# Altium schematic sheet VNA_9.SchDoc: VNA
size 409 x 289 mm; Origin: Eagle; OriginPath: C:\Users\Ground Lab\Desktop\LibreVNA\Hardware\Eagle\VNA.sch; OriginSheet: 10; Date: 04.05.2025 20:03:37; SheetNumber: 10; GateName_1: G$1; SymbolName_1: A3L-LOC; LibraryName: VNA; DeviceSetName: A3L-LOC; Sheet: Sheet:
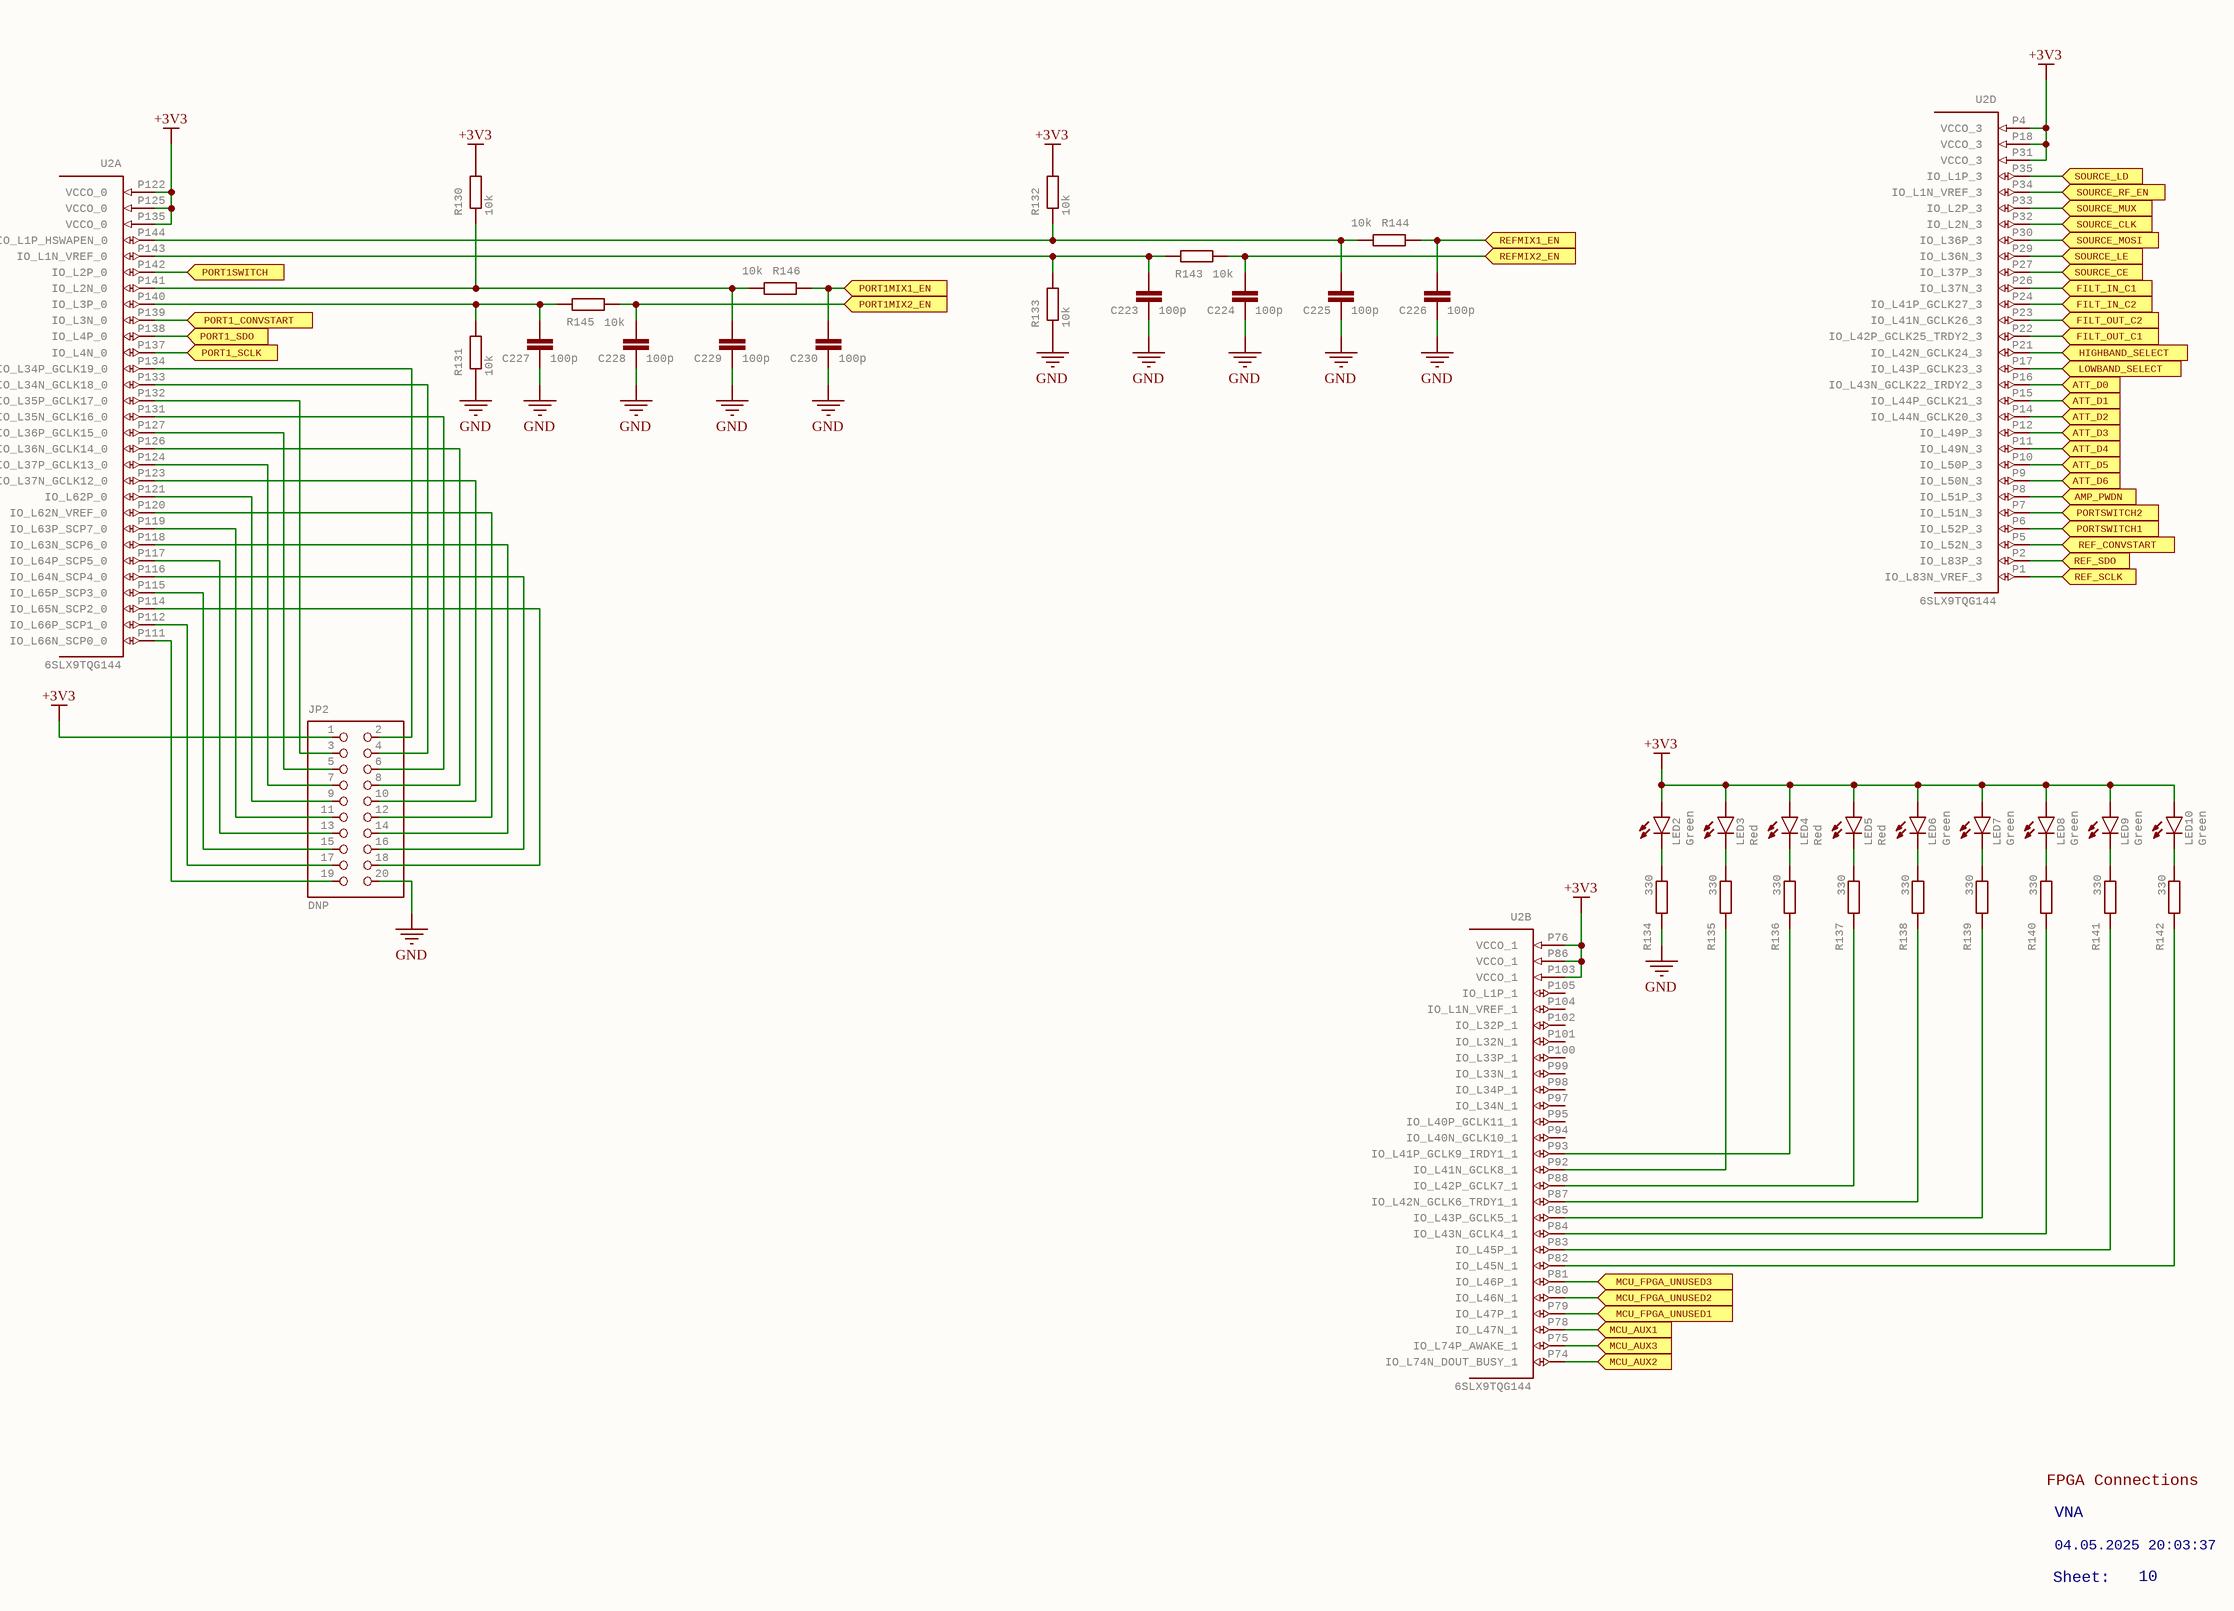
[diagram p0: VNA_9.SchDoc]

## Parts
C223  100p  [C0402]
C224  100p  [C0402]
C225  100p  [C0402]
C226  100p  [C0402]
C227  100p  [C0402]
C228  100p  [C0402]
C229  100p  [C0402]
C230  100p  [C0402]
JP2  DNP  [2X10]
LED2  Green  [CHIPLED_0603]
LED3  Red  [CHIPLED_0603]
LED4  Red  [CHIPLED_0603]
LED5  Red  [CHIPLED_0603]
LED6  Green  [CHIPLED_0603]
LED7  Green  [CHIPLED_0603]
LED8  Green  [CHIPLED_0603]
LED9  Green  [CHIPLED_0603]
LED10  Green  [CHIPLED_0603]
R130  10k  [R0402]
R131  10k  [R0402]
R132  10k  [R0402]
R133  10k  [R0402]
R134  330  [R0402]
R135  330  [R0402]
R136  330  [R0402]
R137  330  [R0402]
R138  330  [R0402]
R139  330  [R0402]
R140  330  [R0402]
R141  330  [R0402]
R142  330  [R0402]
R143  10k  [R0402]
R144  10k  [R0402]
R145  10k  [R0402]
R146  10k  [R0402]
U2  6SLX9TQG144  [TQ144]  (parts A,B,D of 8)

## Ports
AMP_PWDN (in), ATT_D0 (in), ATT_D1 (in), ATT_D2 (in), ATT_D3 (in), ATT_D4 (in), ATT_D5 (in), ATT_D6 (in), FILT_IN_C1 (in), FILT_IN_C2 (in), FILT_OUT_C1 (in), FILT_OUT_C2 (in), HIGHBAND_SELECT (in), LOWBAND_SELECT (in), MCU_AUX1 (in), MCU_AUX2 (in), MCU_AUX3 (in), MCU_FPGA_UNUSED1 (in), MCU_FPGA_UNUSED2 (in), MCU_FPGA_UNUSED3 (in), PORT1_CONVSTART (in), PORT1_SCLK (in), PORT1_SDO (in), PORT1MIX1_EN (in), PORT1MIX2_EN (in), PORT1SWITCH (in), PORTSWITCH1 (in), PORTSWITCH2 (in), REF_CONVSTART (in), REF_SCLK (in), REF_SDO (in), REFMIX1_EN (in), REFMIX2_EN (in), SOURCE_CE (in), SOURCE_CLK (in), SOURCE_LD (in), SOURCE_LE (in), SOURCE_MOSI (in), SOURCE_MUX (in), SOURCE_RF_EN (in)

## Nets
+3V3: JP2.1 JP2.7 LED2.A LED3.A LED4.A LED5.A LED6.A LED7.A LED8.A LED9.A LED10.A R130.2 R132.2 U2.P4(VCCO_3) U2.P18(VCCO_3) U2.P31(VCCO_3) U2.P76(VCCO_1) U2.P86(VCCO_1) U2.P103(VCCO_1) U2.P122(VCCO_0) U2.P124(IO_L37P_GCLK13_0) U2.P125(VCCO_0) U2.P135(VCCO_0)
GND: C223.2 C224.2 C225.2 C226.2 C227.2 C228.2 C229.2 C230.2 JP2.20 R131.1 R133.1 R134.2
AMP_PWDN: U2.P8(IO_L51P_3) ; port AMP_PWDN
ATT_D0: U2.P16(IO_L43N_GCLK22_IRDY2_3) ; port ATT_D0
ATT_D1: U2.P15(IO_L44P_GCLK21_3) ; port ATT_D1
ATT_D2: U2.P14(IO_L44N_GCLK20_3) ; port ATT_D2
ATT_D3: U2.P12(IO_L49P_3) ; port ATT_D3
ATT_D4: U2.P11(IO_L49N_3) ; port ATT_D4
ATT_D5: U2.P10(IO_L50P_3) ; port ATT_D5
ATT_D6: U2.P9(IO_L50N_3) ; port ATT_D6
FILT_IN_C1: U2.P26(IO_L37N_3) ; port FILT_IN_C1
FILT_IN_C2: U2.P24(IO_L41P_GCLK27_3) ; port FILT_IN_C2
FILT_OUT_C1: U2.P22(IO_L42P_GCLK25_TRDY2_3) ; port FILT_OUT_C1
FILT_OUT_C2: U2.P23(IO_L41N_GCLK26_3) ; port FILT_OUT_C2
HIGHBAND_SELECT: U2.P21(IO_L42N_GCLK24_3) ; port HIGHBAND_SELECT
LOWBAND_SELECT: U2.P17(IO_L43P_GCLK23_3) ; port LOWBAND_SELECT
MCU_AUX1: U2.P78(IO_L47N_1) ; port MCU_AUX1
MCU_AUX2: U2.P74(IO_L74N_DOUT_BUSY_1) ; port MCU_AUX2
MCU_AUX3: U2.P75(IO_L74P_AWAKE_1) ; port MCU_AUX3
MCU_FPGA_UNUSED1: U2.P79(IO_L47P_1) ; port MCU_FPGA_UNUSED1
MCU_FPGA_UNUSED2: U2.P80(IO_L46N_1) ; port MCU_FPGA_UNUSED2
MCU_FPGA_UNUSED3: U2.P81(IO_L46P_1) ; port MCU_FPGA_UNUSED3
PORT1_CONVSTART: U2.P139(IO_L3N_0) ; port PORT1_CONVSTART
PORT1_SCLK: U2.P137(IO_L4N_0) ; port PORT1_SCLK
PORT1_SDO: U2.P138(IO_L4P_0) ; port PORT1_SDO
PORT1MIX1_EN: C230.1 R146.2 ; port PORT1MIX1_EN
PORT1MIX2_EN: C228.1 R145.1 ; port PORT1MIX2_EN
PORT1SWITCH: U2.P142(IO_L2P_0) ; port PORT1SWITCH
PORTSWITCH1: U2.P6(IO_L52P_3) ; port PORTSWITCH1
PORTSWITCH2: U2.P7(IO_L51N_3) ; port PORTSWITCH2
REF_CONVSTART: U2.P5(IO_L52N_3) ; port REF_CONVSTART
REF_SCLK: U2.P1(IO_L83N_VREF_3) ; port REF_SCLK
REF_SDO: U2.P2(IO_L83P_3) ; port REF_SDO
REFMIX1_EN: C226.1 R144.2 ; port REFMIX1_EN
REFMIX2_EN: C224.1 R143.1 ; port REFMIX2_EN
SOURCE_CE: U2.P27(IO_L37P_3) ; port SOURCE_CE
SOURCE_CLK: U2.P32(IO_L2N_3) ; port SOURCE_CLK
SOURCE_LD: U2.P35(IO_L1P_3) ; port SOURCE_LD
SOURCE_LE: U2.P29(IO_L36N_3) ; port SOURCE_LE
SOURCE_MOSI: U2.P30(IO_L36P_3) ; port SOURCE_MOSI
SOURCE_MUX: U2.P33(IO_L2P_3) ; port SOURCE_MUX
SOURCE_RF_EN: U2.P34(IO_L1N_VREF_3) ; port SOURCE_RF_EN
NetC223_1: C223.1 R133.2 R143.2 U2.P143(IO_L1N_VREF_0)
NetC225_1: C225.1 R132.1 R144.1 U2.P144(IO_L1P_HSWAPEN_0)
NetC227_1: C227.1 R131.2 R145.2 U2.P140(IO_L3P_0)
NetC229_1: C229.1 R130.1 R146.1 U2.P141(IO_L2N_0)
NetJP2_2: JP2.2 U2.P134(IO_L34P_GCLK19_0)
NetJP2_3: JP2.3 U2.P132(IO_L35P_GCLK17_0)
NetJP2_4: JP2.4 U2.P133(IO_L34N_GCLK18_0)
NetJP2_5: JP2.5 U2.P127(IO_L36P_GCLK15_0)
NetJP2_6: JP2.6 U2.P131(IO_L35N_GCLK16_0)
NetJP2_8: JP2.8 U2.P126(IO_L36N_GCLK14_0)
NetJP2_9: JP2.9 U2.P121(IO_L62P_0)
NetJP2_10: JP2.10 U2.P123(IO_L37N_GCLK12_0)
NetJP2_11: JP2.11 U2.P119(IO_L63P_SCP7_0)
NetJP2_12: JP2.12 U2.P120(IO_L62N_VREF_0)
NetJP2_13: JP2.13 U2.P117(IO_L64P_SCP5_0)
NetJP2_14: JP2.14 U2.P118(IO_L63N_SCP6_0)
NetJP2_15: JP2.15 U2.P115(IO_L65P_SCP3_0)
NetJP2_16: JP2.16 U2.P116(IO_L64N_SCP4_0)
NetJP2_17: JP2.17 U2.P112(IO_L66P_SCP1_0)
NetJP2_18: JP2.18 U2.P114(IO_L65N_SCP2_0)
NetJP2_19: JP2.19 U2.P111(IO_L66N_SCP0_0)
NetLED2_C: LED2.C R134.1
NetLED3_C: LED3.C R135.1
NetLED4_C: LED4.C R136.1
NetLED5_C: LED5.C R137.1
NetLED6_C: LED6.C R138.1
NetLED7_C: LED7.C R139.1
NetLED8_C: LED8.C R140.1
NetLED9_C: LED9.C R141.1
NetLED10_C: LED10.C R142.1
NetR135_2: R135.2 U2.P92(IO_L41N_GCLK8_1)
NetR136_2: R136.2 U2.P93(IO_L41P_GCLK9_IRDY1_1)
NetR137_2: R137.2 U2.P88(IO_L42P_GCLK7_1)
NetR138_2: R138.2 U2.P87(IO_L42N_GCLK6_TRDY1_1)
NetR139_2: R139.2 U2.P85(IO_L43P_GCLK5_1)
NetR140_2: R140.2 U2.P84(IO_L43N_GCLK4_1)
NetR141_2: R141.2 U2.P83(IO_L45P_1)
NetR142_2: R142.2 U2.P82(IO_L45N_1)

Not connected (* = marked no-connect by the designer): U2 P94(IO_L40N_GCLK10_1) P95(IO_L40P_GCLK11_1) P97(IO_L34N_1) P98(IO_L34P_1) P99(IO_L33N_1) P100(IO_L33P_1) P101(IO_L32N_1) P102(IO_L32P_1) P104(IO_L1N_VREF_1) P105(IO_L1P_1)

## Notes on the sheet
- FPGA Connections
- VNA
- Sheet:
- 04.05.2025 20:03:37
- 10

## Library data of the parts
C223-C230 = C-EU*?:2C0402: CAPACITOR, European symbol; GateName_1: G$1; SymbolName_1: C-EU:1; DeviceName: C0402; LibraryName: VNA; DeviceSetName: C-EU*?:2
JP2 = PINHD-2X10: PIN HEADER; GateName_1: A; SymbolName_1: PINH2X10; LibraryName: VNA; DeviceSetName: PINHD-2X10
LED2-LED10 = LEDCHIPLED_0603: LED   OSRAM: - CHIPLED LG R971, LG N971, LY N971, LG Q971, LY Q971, LO R971, LY R971 LH N974, LH R974 LS Q976, LO Q976, LY Q976 LO Q996 - Hyper CHIPLED LW Q18S LB Q993, LB Q99A, LB R99A - SideLED LS A670, LO A670, LY A670, LG A670, LP A670 LB A673, LV A673, LT A673, LW A673 LH A674 LY A675 LS A676, LA A676, LO A676, LY A676, LW A676 LS A679, LY A679, LG A679 -  Hyper Micro SIDELEDÂ® LS Y876, LA Y876, LO Y876, LY Y876 LT Y87S - SmartLED LW L88C, LW L88S LB L89C, LB L89S, LG L890 LS L89K, LO L89K, LY L89K LS L896, LA L896, LO L896, LY L896 - TOPLED LS T670, LO T670, LY T670, LG T670, LP T670 LSG T670, LSP T670, LSY T670, LOP T670, LYG T670 LG T671, LOG T671, LSG T671 LB T673, LV T673, LT T673, LW T673 LH T674 LS T676, LA T676, LO T676, LY T676, LB T676, LH T676, LSB T676, LW T676 LB T67C, LV T67C, LT T67C, LS T67K, LO T67K, LY T67K, LW E67C LS E67B, LA E67B, LO E67B, LY E67B, LB E67C, LV E67C, LT E67C LW T67C LS T679, LY T679, LG T679 LS T770, LO T770, LY T770, LG T770, LP T770 LB T773, LV T773, LT T773, LW T773 LH T774 LS E675, LA E675, LY E675, LS T675 LS T776, LA T776, LO T776, LY T776, LB T776 LHGB T686 LT T68C, LB T68C - Hyper Mini TOPLEDÂ® LB M676 - Mini TOPLED SantanaÂ® LG M470 LS M47K, LO M47K, LY M47K    Source: http://www.osram.convergy.de   LUXEON: - LUMILEDÂ® LXK2-PW12-R00, LXK2-PW12-S00, LXK2-PW14-U00, LXK2-PW14-V00 LXK2-PM12-R00, LXK2-PM12-S00, LXK2-PM14-U00 LXK2-PE12-Q00, LXK2-PE12-R00, LXK2-PE12-S00, LXK2-PE14-T00, LXK2-PE14-U00 LXK2-PB12-K00, LXK2-PB12-L00, LXK2-PB12-M00, LXK2-PB14-N00, LXK2-PB14-P00, LXK2-PB14-Q00 LXK2-PR12-L00, LXK2-PR12-M00, LXK2-PR14-Q00, LXK2-PR14-R00 LXK2-PD12-Q00, LXK2-PD12-R00, LXK2-PD12-S00 LXK2-PH12-R00, LXK2-PH12-S00 LXK2-PL12-P00, LXK2-PL12-Q00, LXK2-PL12-R00    Source: www.luxeon.com   KINGBRIGHT:   KA-3528ASYC Source: www.kingbright.com; GateName_1: G$1; POPULARITY: 0; SymbolName_1: LED; DeviceName: CHIPLED_0603; LibraryName: VNA; DeviceSetName: LED
R130-R146 = R-EU_R0402: RESISTOR, European symbol; GateName_1: G$1; SymbolName_1: R-EU; DeviceSetName: R-EU_; DeviceName: R0402; LibraryName: VNA
U2 = 6SLX9TQG144: Xilinx FPGA: 6SLX9TQG144; GateName_1: B0; SymbolName_1: 6SLX9TQG144_0; GateName_2: B1; SymbolName_2: 6SLX9TQG144_1; GateName_3: B2; SymbolName_3: 6SLX9TQG144_2; GateName_4: B3; SymbolName_4: 6SLX9TQG144_3; GateName_5: BGND; SymbolName_5: 6SLX9TQG144_GND; GateName_6: BNA; SymbolName_6: 6SLX9TQG144_NA; GateName_7: BVCCAUX; SymbolName_7: 6SLX9TQG144_VCCAUX; GateName_8: BVCCINT; SymbolName_8: 6SLX9TQG144_VCCINT; LibraryName: VNA; DeviceSetName: 6SLX9TQG144